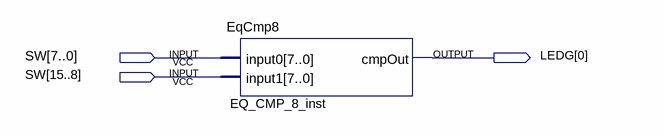
[diagram p0: schematic sheet]
// Quartus schematic EqCmpDemo8.bdf as structural Verilog: 1 symbols, 3 pins
module EqCmpDemo8 (
  input  [15:0] SW,
  output [0:0] LEDG
);

  EqCmp8 EQ_CMP_8_inst (.input0(SW[7:0]), .input1(SW[15:8]), .cmpOut(LEDG[0]));
endmodule
